# Altium schematic sheet ZYNQ400-EMIO.SchDoc
size A3
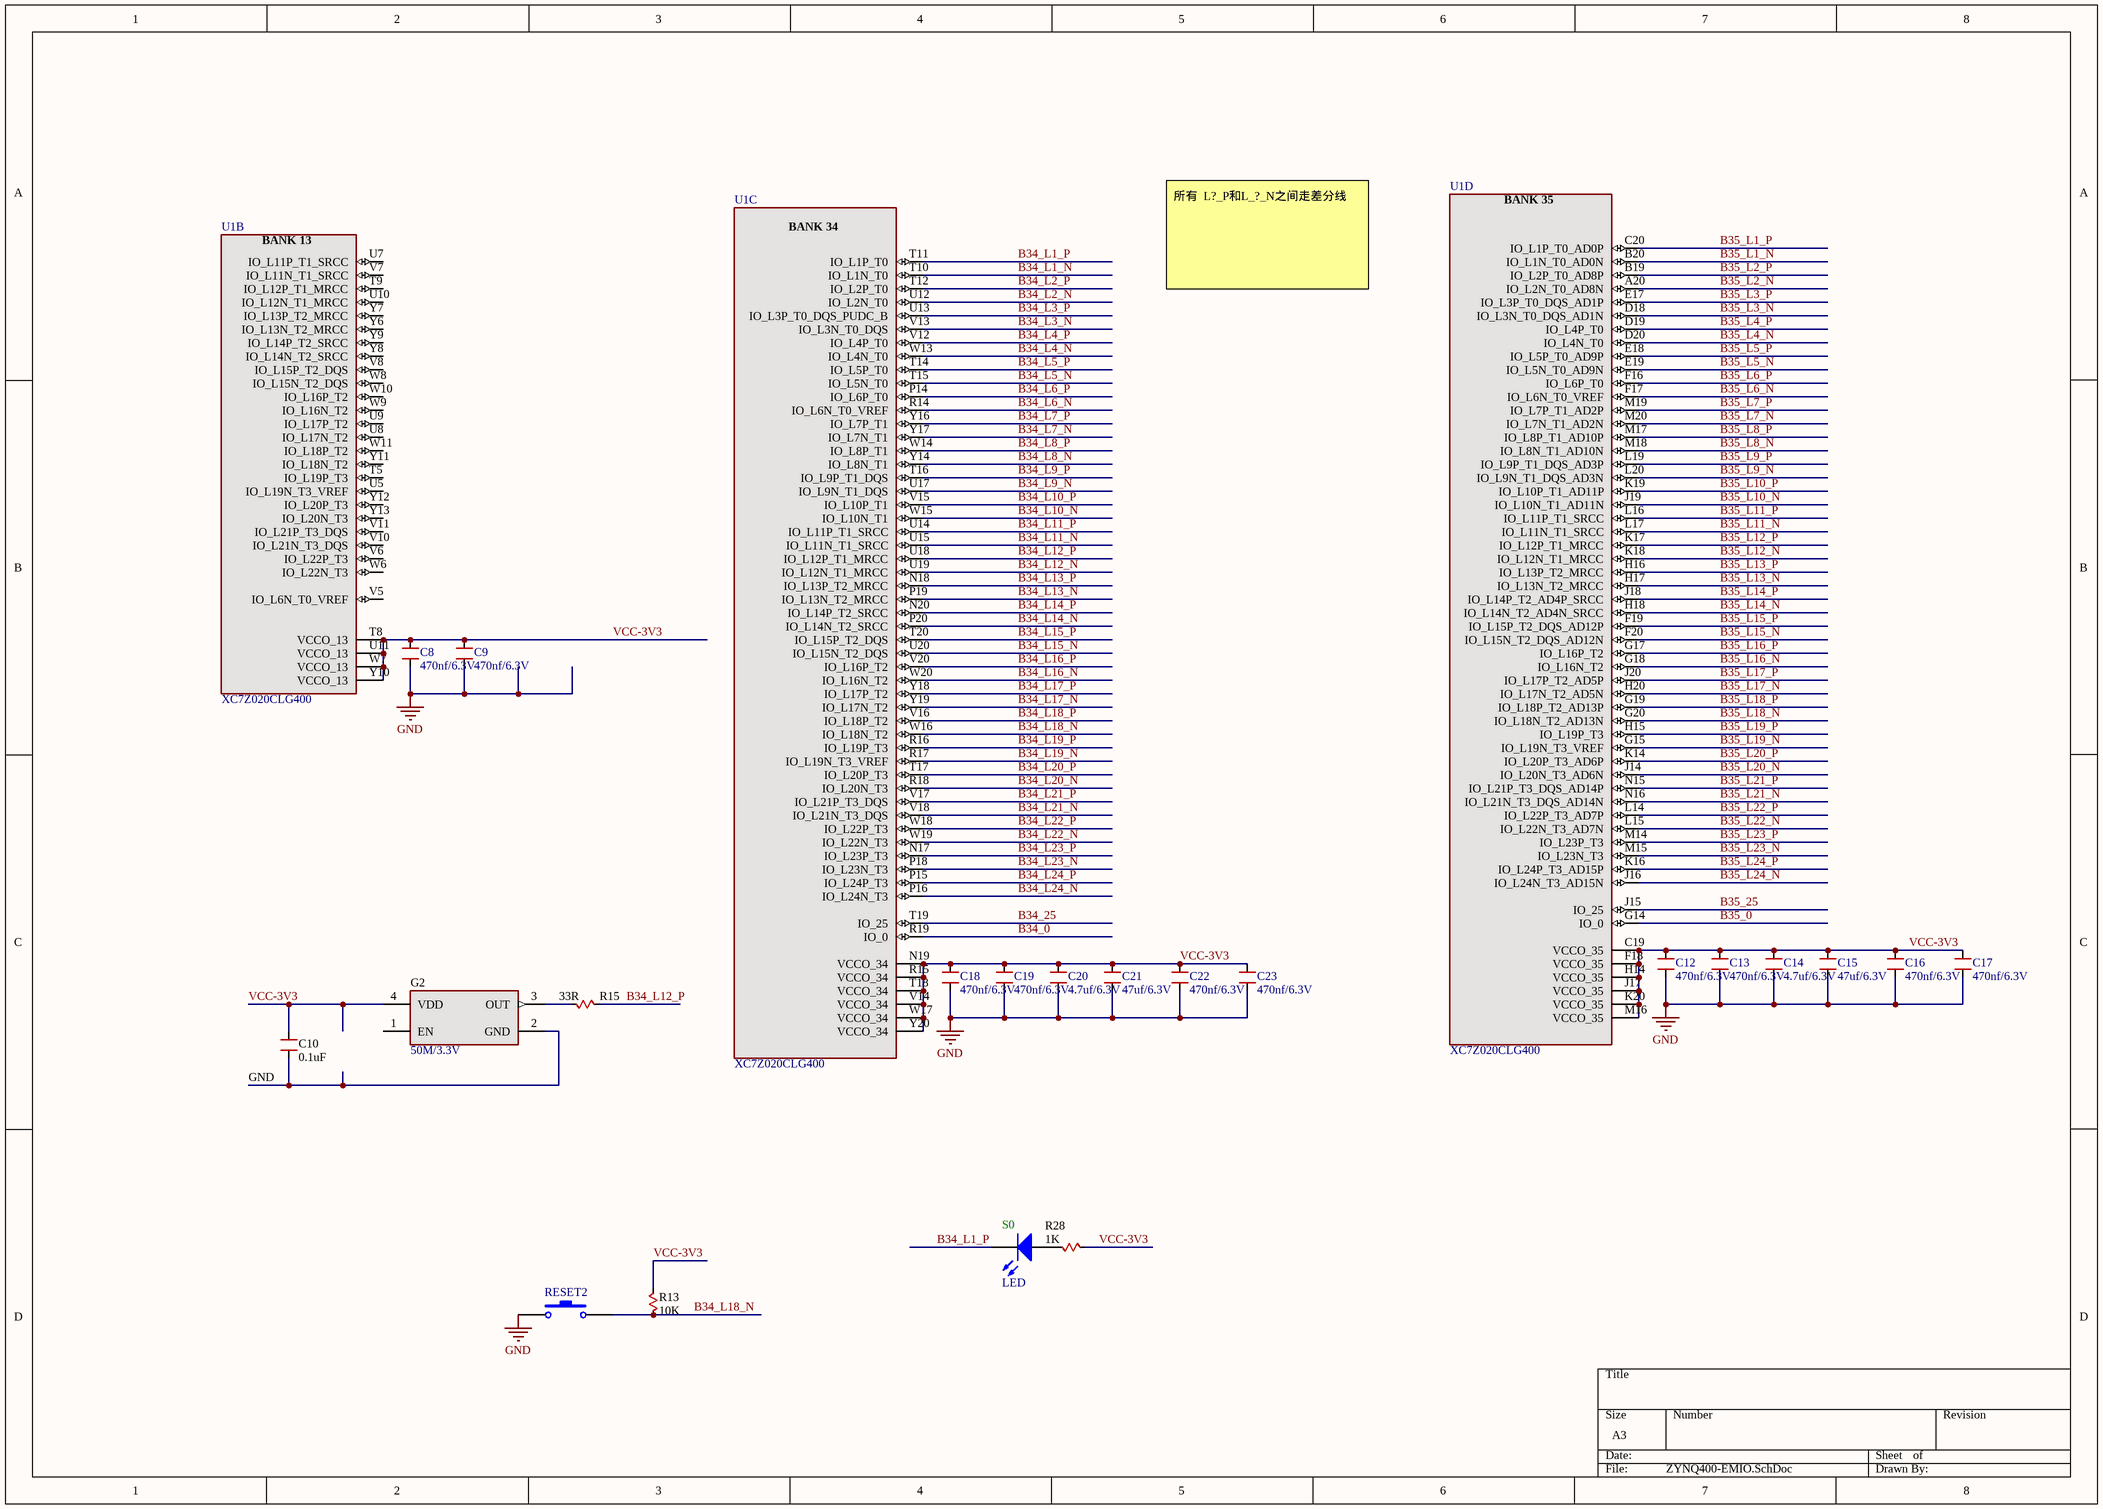
[diagram p0: ZYNQ400-EMIO.SchDoc]

## Parts
C8  470nf/6.3V  [0402]
C9  470nf/6.3V  [0402]
C10  0.1UF  [0402]
C12  470nf/6.3V  [0402]
C13  470nf/6.3V  [0402]
C14  4.7uf/6.3V  [0402]
C15  47uf/6.3V  [0402]
C16  470nf/6.3V  [0402]
C17  470nf/6.3V  [0402]
C18  470nf/6.3V  [0402]
C19  470nf/6.3V  [0402]
C20  4.7uf/6.3V  [0402]
C21  47uf/6.3V  [0402]
C22  470nf/6.3V  [0402]
C23  470nf/6.3V  [0402]
G2  50M/3.3V  [3.2*2.5]
R13  10K  [0402]
R15  33R  [0402]
R28  1K  [0402]
RESET2  SW-PB  [micro button_2_SMD]  (value not drawn)
S0  LED  [D0402]
U1  XC7Z020CLG400  [CLG400]  (parts B,C,D of 9)

## Nets
GND: C8.2 C9.2 C10.2 C12.2 C13.2 C14.2 C15.2 C16.2 C17.2 C18.2 C19.2 C20.2 C21.2 C22.2 C23.2 G2.2(GND) RESET2.1
B34_0: U1.R19(IO_0)
B34_25: U1.T19(IO_25)
B34_L1_N: U1.T10(IO_L1N_T0)
B34_L1_P: S0.2(K) U1.T11(IO_L1P_T0)
B34_L2_N: U1.U12(IO_L2N_T0)
B34_L2_P: U1.T12(IO_L2P_T0)
B34_L3_N: U1.V13(IO_L3N_T0_DQS)
B34_L3_P: U1.U13(IO_L3P_T0_DQS_PUDC_B)
B34_L4_N: U1.W13(IO_L4N_T0)
B34_L4_P: U1.V12(IO_L4P_T0)
B34_L5_N: U1.T15(IO_L5N_T0)
B34_L5_P: U1.T14(IO_L5P_T0)
B34_L6_N: U1.R14(IO_L6N_T0_VREF)
B34_L6_P: U1.P14(IO_L6P_T0)
B34_L7_N: U1.Y17(IO_L7N_T1)
B34_L7_P: U1.Y16(IO_L7P_T1)
B34_L8_N: U1.Y14(IO_L8N_T1)
B34_L8_P: U1.W14(IO_L8P_T1)
B34_L9_N: U1.U17(IO_L9N_T1_DQS)
B34_L9_P: U1.T16(IO_L9P_T1_DQS)
B34_L10_N: U1.W15(IO_L10N_T1)
B34_L10_P: U1.V15(IO_L10P_T1)
B34_L11_N: U1.U15(IO_L11N_T1_SRCC)
B34_L11_P: U1.U14(IO_L11P_T1_SRCC)
B34_L12_N: U1.U19(IO_L12N_T1_MRCC)
B34_L12_P: R15.2 U1.U18(IO_L12P_T1_MRCC)
B34_L13_N: U1.P19(IO_L13N_T2_MRCC)
B34_L13_P: U1.N18(IO_L13P_T2_MRCC)
B34_L14_N: U1.P20(IO_L14N_T2_SRCC)
B34_L14_P: U1.N20(IO_L14P_T2_SRCC)
B34_L15_N: U1.U20(IO_L15N_T2_DQS)
B34_L15_P: U1.T20(IO_L15P_T2_DQS)
B34_L16_N: U1.W20(IO_L16N_T2)
B34_L16_P: U1.V20(IO_L16P_T2)
B34_L17_N: U1.Y19(IO_L17N_T2)
B34_L17_P: U1.Y18(IO_L17P_T2)
B34_L18_N: R13.1 RESET2.2 U1.W16(IO_L18N_T2)
B34_L18_P: U1.V16(IO_L18P_T2)
B34_L19_N: U1.R17(IO_L19N_T3_VREF)
B34_L19_P: U1.R16(IO_L19P_T3)
B34_L20_N: U1.R18(IO_L20N_T3)
B34_L20_P: U1.T17(IO_L20P_T3)
B34_L21_N: U1.V18(IO_L21N_T3_DQS)
B34_L21_P: U1.V17(IO_L21P_T3_DQS)
B34_L22_N: U1.W19(IO_L22N_T3)
B34_L22_P: U1.W18(IO_L22P_T3)
B34_L23_N: U1.P18(IO_L23N_T3)
B34_L23_P: U1.N17(IO_L23P_T3)
B34_L24_N: U1.P16(IO_L24N_T3)
B34_L24_P: U1.P15(IO_L24P_T3)
B35_0: U1.G14(IO_0)
B35_25: U1.J15(IO_25)
B35_L1_N: U1.B20(IO_L1N_T0_AD0N)
B35_L1_P: U1.C20(IO_L1P_T0_AD0P)
B35_L2_N: U1.A20(IO_L2N_T0_AD8N)
B35_L2_P: U1.B19(IO_L2P_T0_AD8P)
B35_L3_N: U1.D18(IO_L3N_T0_DQS_AD1N)
B35_L3_P: U1.E17(IO_L3P_T0_DQS_AD1P)
B35_L4_N: U1.D20(IO_L4N_T0)
B35_L4_P: U1.D19(IO_L4P_T0)
B35_L5_N: U1.E19(IO_L5N_T0_AD9N)
B35_L5_P: U1.E18(IO_L5P_T0_AD9P)
B35_L6_N: U1.F17(IO_L6N_T0_VREF)
B35_L6_P: U1.F16(IO_L6P_T0)
B35_L7_N: U1.M20(IO_L7N_T1_AD2N)
B35_L7_P: U1.M19(IO_L7P_T1_AD2P)
B35_L8_N: U1.M18(IO_L8N_T1_AD10N)
B35_L8_P: U1.M17(IO_L8P_T1_AD10P)
B35_L9_N: U1.L20(IO_L9N_T1_DQS_AD3N)
B35_L9_P: U1.L19(IO_L9P_T1_DQS_AD3P)
B35_L10_N: U1.J19(IO_L10N_T1_AD11N)
B35_L10_P: U1.K19(IO_L10P_T1_AD11P)
B35_L11_N: U1.L17(IO_L11N_T1_SRCC)
B35_L11_P: U1.L16(IO_L11P_T1_SRCC)
B35_L12_N: U1.K18(IO_L12N_T1_MRCC)
B35_L12_P: U1.K17(IO_L12P_T1_MRCC)
B35_L13_N: U1.H17(IO_L13N_T2_MRCC)
B35_L13_P: U1.H16(IO_L13P_T2_MRCC)
B35_L14_N: U1.H18(IO_L14N_T2_AD4N_SRCC)
B35_L14_P: U1.J18(IO_L14P_T2_AD4P_SRCC)
B35_L15_N: U1.F20(IO_L15N_T2_DQS_AD12N)
B35_L15_P: U1.F19(IO_L15P_T2_DQS_AD12P)
B35_L16_N: U1.G18(IO_L16N_T2)
B35_L16_P: U1.G17(IO_L16P_T2)
B35_L17_N: U1.H20(IO_L17N_T2_AD5N)
B35_L17_P: U1.J20(IO_L17P_T2_AD5P)
B35_L18_N: U1.G20(IO_L18N_T2_AD13N)
B35_L18_P: U1.G19(IO_L18P_T2_AD13P)
B35_L19_N: U1.G15(IO_L19N_T3_VREF)
B35_L19_P: U1.H15(IO_L19P_T3)
B35_L20_N: U1.J14(IO_L20N_T3_AD6N)
B35_L20_P: U1.K14(IO_L20P_T3_AD6P)
B35_L21_N: U1.N16(IO_L21N_T3_DQS_AD14N)
B35_L21_P: U1.N15(IO_L21P_T3_DQS_AD14P)
B35_L22_N: U1.L15(IO_L22N_T3_AD7N)
B35_L22_P: U1.L14(IO_L22P_T3_AD7P)
B35_L23_N: U1.M15(IO_L23N_T3)
B35_L23_P: U1.M14(IO_L23P_T3)
B35_L24_N: U1.J16(IO_L24N_T3_AD15N)
B35_L24_P: U1.K16(IO_L24P_T3_AD15P)
VCC-3V3: C8.1 C9.1 C10.1 C12.1 C13.1 C14.1 C15.1 C16.1 C17.1 C18.1 C19.1 C20.1 C21.1 C22.1 C23.1 G2.4(VDD) R13.2 R28.2 U1.C19(VCCO_35) U1.F18(VCCO_35) U1.H14(VCCO_35) U1.J17(VCCO_35) U1.K20(VCCO_35) U1.M16(VCCO_35) U1.N19(VCCO_34) U1.R15(VCCO_34) U1.T8(VCCO_13) U1.T18(VCCO_34) U1.U11(VCCO_13) U1.V14(VCCO_34) U1.W7(VCCO_13) U1.W17(VCCO_34) U1.Y10(VCCO_13) U1.Y20(VCCO_34)
NetG2_3: G2.3(OUT) R15.1
NetR28_1: R28.1 S0.1(A)

Not connected (* = marked no-connect by the designer): G2 1(EN); U1 T5(IO_L19P_T3) T9(IO_L12P_T1_MRCC) U5(IO_L19N_T3_VREF) U7(IO_L11P_T1_SRCC) U8(IO_L17N_T2) U9(IO_L17P_T2) U10(IO_L12N_T1_MRCC) V5(IO_L6N_T0_VREF) V6(IO_L22P_T3) V7(IO_L11N_T1_SRCC) V8(IO_L15P_T2_DQS) V10(IO_L21N_T3_DQS) V11(IO_L21P_T3_DQS) W6(IO_L22N_T3) W8(IO_L15N_T2_DQS) W9(IO_L16N_T2) W10(IO_L16P_T2) W11(IO_L18P_T2) Y6(IO_L13N_T2_MRCC) Y7(IO_L13P_T2_MRCC) Y8(IO_L14N_T2_SRCC) Y9(IO_L14P_T2_SRCC) Y11(IO_L18N_T2) Y12(IO_L20P_T3) Y13(IO_L20N_T3)

## Notes on the sheet
- 所有  L?_P和L_?_N之间走差分线
- (in symbol XC7Z020-CLG400, part B) BANK 13
- (in symbol XC7Z020-CLG400, part C) BANK 34
- (in symbol XC7Z020-CLG400, part D) BANK 35

## Library data of the parts
C8-C10 C12-C23 = CAPACITOR: Generic Capacitor; DPN: *; Manufacturer: *
  C10: Value: 0.1uF
G2 = FXO-HC5: 3.3V HCMOS Oscillator; Manufacturer: Fox Electronics; Value: 33.33MHz; DPN: *
R13 R15 R28 = RESISTOR: Generic Resistor; Manufacturer: *; DPN: *
  R13: Value: 10K
  R15: Value: 33R
  R28: Value: 1K
RESET2 = SW-PB: Switch; Published: 24-Mar-1999; LatestRevisionDate: 17-Jul-2002; LatestRevisionNote: Re-released for DXP Platform.; PackageReference: SPST-2; Publisher: Altium Limited; PackageDescription: Switch; 2 Leads
S0 = LED0: Typical INFRARED GaAs LED; Published: 8-Jun-2000; LatestRevisionDate: 08-Jul-2005; LatestRevisionNote: Mech Layer 1 removed.; PackageReference: LED-0; Publisher: Altium Limited; PackageDescription: LED; 2 Leads
U1 = XC7Z020-CLG400: Zynq 7000 FPGA 20 Die, in a CSG 484 Package; Manufacturer: Xilinx; DPN: *; Die: *